# Altium project stm32f103c8t6.PrjPcb
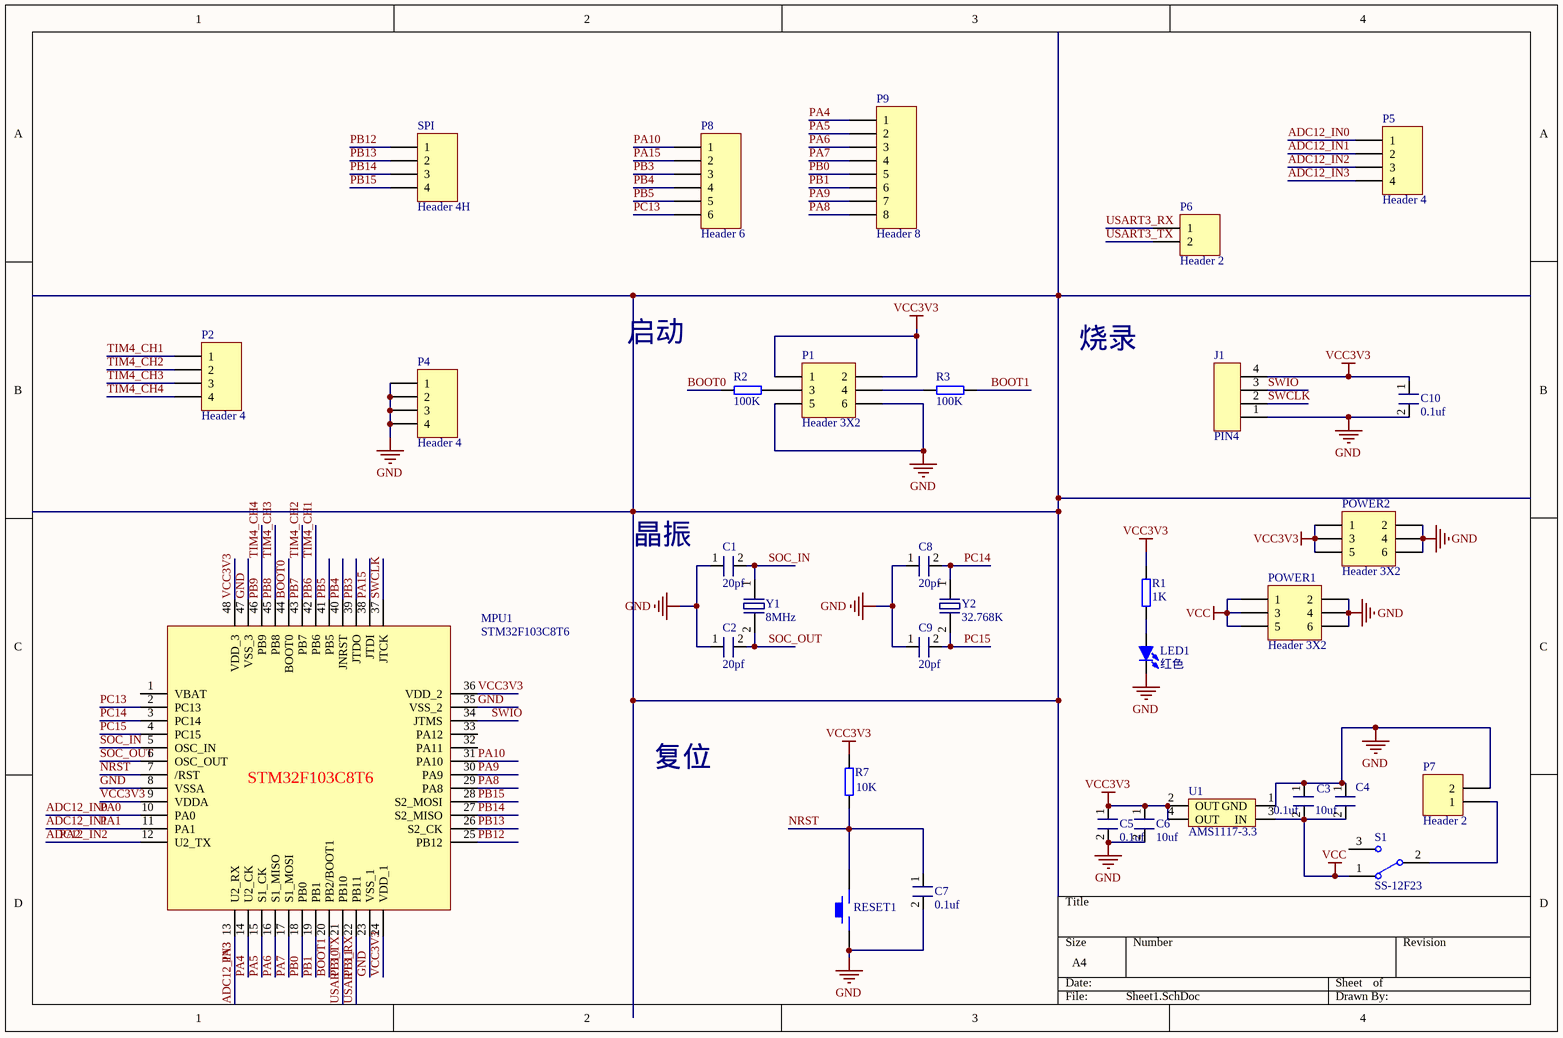
[diagram p0: Sheet1.SchDoc]
2 sheets, 46 parts. Net scope: global (net labels, ports and power ports of the same name join across sheets).
Board file: PCB1.PcbDoc
Sheets:
  Sheet1.SchDoc
  Sheet3.SchDoc

## Sheet Sheet1.SchDoc
size A4

### Parts
C1  20pf  [0603-C]
C2  20pf  [0603-C]
C3  0.1uf  [0603-C]
C4  10uf  [0603-C]
C5  0.1uf  [0603-C]
C6  10uf  [0603-C]
C7  0.1uf  [0603-C]
C8  20pf  [0603-C]
C9  20pf  [0603-C]
C10  0.1uf  [0603-C]
J1  PIN4  [HDR-1X4_H]
LED1  红色  [LED 0603W]
MPU1  STM32F103C8T6  [stm32f103c8t6]
P1  Header 3X2  [HDR2X3]
P2  Header 4  [HDR1X4]
P4  Header 4  [HDR1X4]
P5  Header 4  [HDR1X4]
P6  Header 2  [HDR-1X2_H]
P7  Header 2  [TX60PW-F20]
P8  Header 6  [HDR1X6]
P9  Header 8  [HDR1X8]
POWER1  Header 3X2  [HDR-3X2]
POWER2  Header 3X2  [HDR-3X2]
R1  1K  [0603-R]
R2  100K  [0603-R]
R3  100K  [0603-R]
R7  10K  [0603-R]
RESET1  KEY_M  [TSW SMD-6*6*11]  (value not drawn)
S1  SS-12F23  [SS-12D10]
SPI  Header 4H  [HDR1X4H]
U1  AMS1117-3.3  [AMS1117]
Y1  8MHz  [XTAL]
Y2  32.768K  [SMD8038-4]

### Nets
GND: C1.1 C2.1 C3.1 C4.1 C5.2 C6.2 C7.2 C8.1 C9.1 C10.2 J1.1 LED1.2(K) MPU1.8(VSSA) MPU1.23(VSS_1) MPU1.35(VSS_2) MPU1.47(VSS_3) P1.5 P1.6 P4.1 P4.2 P4.3 P4.4 P7.2 POWER1.2 POWER1.4 POWER1.6 POWER2.2 POWER2.4 POWER2.6 RESET1.1 U1.1(GND)
VCC: C3.2 C4.2 POWER1.1 POWER1.3 POWER1.5 S1.1 U1.3(IN)
VCC3V3: C5.1 C6.1 C10.1 J1.4 MPU1.9(VDDA) MPU1.24(VDD_1) MPU1.36(VDD_2) MPU1.48(VDD_3) P1.1 P1.2 POWER2.1 POWER2.3 POWER2.5 R1.1 R7.2 U1.2(OUT) U1.4(OUT)
ADC12_IN0: MPU1.10(PA0) P5.1  [also labelled PA0]
ADC12_IN1: MPU1.11(PA1) P5.2  [also labelled PA1]
ADC12_IN2: MPU1.12(U2_TX) P5.3  [also labelled PA2]
ADC12_IN3: MPU1.13(U2_RX) P5.4  [also labelled PA3]
BOOT0: MPU1.44(BOOT0) R2.1
BOOT1: MPU1.20(PB2/BOOT1) R3.2
NRST: C7.1 MPU1.7(/RST) R7.1 RESET1.2
PA4: MPU1.14(U2_CK) P9.1
PA5: MPU1.15(S1_CK) P9.2
PA6: MPU1.16(S1_MISO) P9.3
PA7: MPU1.17(S1_MOSI) P9.4
PA8: MPU1.29(PA8) P9.8
PA9: MPU1.30(PA9) P9.7
PA10: MPU1.31(PA10) P8.1
PA15: MPU1.38(JTDI) P8.2
PB0: MPU1.18(PB0) P9.5
PB1: MPU1.19(PB1) P9.6
PB3: MPU1.39(JTDO) P8.3
PB4: MPU1.40(JNRST) P8.4
PB5: MPU1.41(PB5) P8.5
PB6: MPU1.42(PB6) P2.1  [also labelled TIM4_CH1]
PB7: MPU1.43(PB7) P2.2  [also labelled TIM4_CH2]
PB8: MPU1.45(PB8) P2.3  [also labelled TIM4_CH3]
PB9: MPU1.46(PB9) P2.4  [also labelled TIM4_CH4]
PB10: MPU1.21(PB10) P6.2  [also labelled USART3_TX]
PB11: MPU1.22(PB11) P6.1  [also labelled USART3_RX]
PB12: MPU1.25(PB12) SPI.1
PB13: MPU1.26(S2_CK) SPI.2
PB14: MPU1.27(S2_MISO) SPI.3
PB15: MPU1.28(S2_MOSI) SPI.4
PC13: MPU1.2(PC13) P8.6
PC14: C8.2 MPU1.3(PC14) Y2.1
PC15: C9.2 MPU1.4(PC15) Y2.2
SOC_IN: C1.2 MPU1.5(OSC_IN) Y1.1
SOC_OUT: C2.2 MPU1.6(OSC_OUT) Y1.2
SWCLK: J1.2 MPU1.37(JTCK)
SWIO: J1.3 MPU1.34(JTMS)
NetLED1_1: LED1.1(A) R1.2
NetP1_3: P1.3 R2.2
NetP1_4: P1.4 R3.1
NetP7_1: P7.1 S1.2

Not connected (* = marked no-connect by the designer): MPU1 1(VBAT) 32(PA11) 33(PA12); S1 3

### Notes on the sheet
- 启动
- 烧录
- 晶振
- 复位

### Library data of the parts
C1-C10 = Cap
LED1 = LED-SMD: 贴片LED; 版权归属: 黎明电子style; BOM名称: 贴片LED; 学习资源: https://lmdzstyle.taobao.com/
P1 POWER1 POWER2 = Header 3X2: Header, 3-Pin, Dual row; LatestRevisionDate: 17-Jul-2002; LatestRevisionNote: Re-released for DXP Platform.; Publisher: Altium Limited
P2 P4 P5 = Header 4: Header, 4-Pin; LatestRevisionDate: 17-Jul-2002; LatestRevisionNote: Re-released for DXP Platform.; Publisher: Altium Limited
P6 P7 = Header 2: Header, 2-Pin; LatestRevisionDate: 17-Jul-2002; LatestRevisionNote: Re-released for DXP Platform.; Publisher: Altium Limited
P8 = Header 6: Header, 6-Pin; LatestRevisionDate: 17-Jul-2002; LatestRevisionNote: Re-released for DXP Platform.; Publisher: Altium Limited
P9 = Header 8: Header, 8-Pin; LatestRevisionDate: 17-Jul-2002; LatestRevisionNote: Re-released for DXP Platform.; Publisher: Altium Limited
R1-R3 R7 = RES-SMD
S1 = SSW-1P: 1路波动开关; BOM名称: 波动开关; 版权归属: 黎明电子style; 学习资源: https://lmdzstyle.taobao.com/
SPI = Header 4H: Header, 4-Pin, Right Angle; LatestRevisionDate: 17-Jul-2002; LatestRevisionNote: Re-released for DXP Platform.; Publisher: Altium Limited
U1 = AMS1117
Y1 Y2 = XTAL

## Sheet Sheet3.SchDoc
size A4
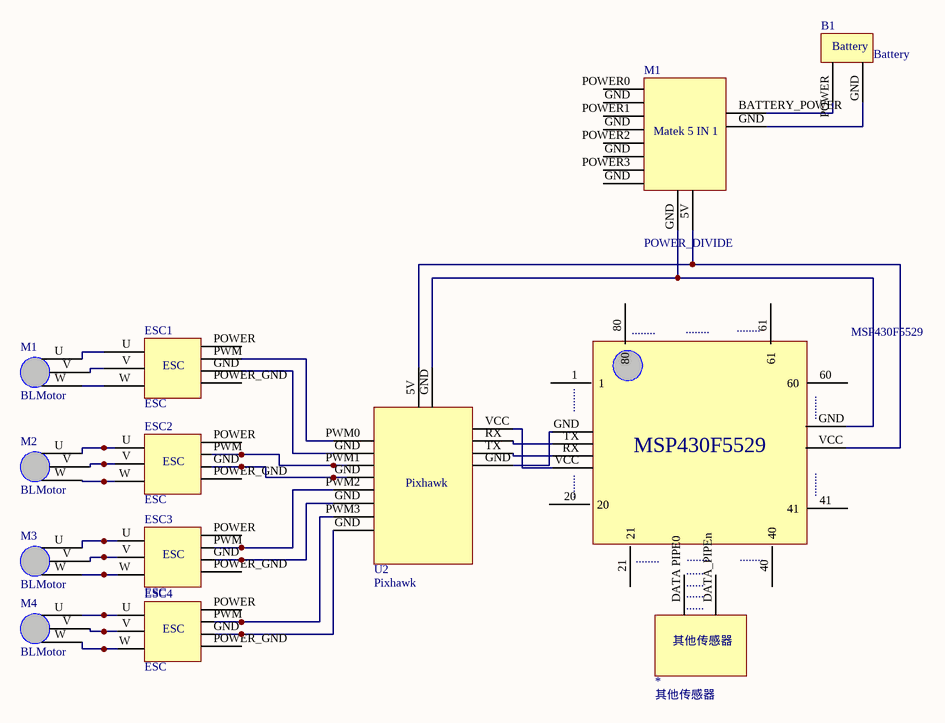
[diagram p1: Sheet3.SchDoc]

### Parts
(Parts that share a designator on the sheet are numbered #1, #2 ... from top to bottom, then left to right.)
*  其他传感器
B1  Battery
ESC1  ESC
ESC2  ESC
ESC3  ESC
ESC4  ESC
M1#1  POWER_DIVIDE
M1#2  BLMotor
M2  BLMotor
M3  BLMotor
M4  BLMotor
U2  Pixhawk
  MSP430F5529

### Nets
NetB1_GND: B1.GND M1#1.GND
NetB1_POWER: B1.POWER M1#1.BATTERY_POWER
NetESC1_GND: ESC1.GND U2.GND
NetESC1_PWM: ESC1.PWM U2.PWM0
NetESC1_U: ESC1.U M1#2.U
NetESC1_V: ESC1.V M1#2.V
NetESC1_W: ESC1.W M1#2.W
NetESC2_GND: ESC2.GND U2.GND
NetESC2_PWM: ESC2.PWM U2.PWM1
NetESC2_U: ESC2.U M2.U
NetESC2_V: ESC2.V M2.V
NetESC2_W: ESC2.W M2.W
NetESC3_GND: ESC3.GND U2.GND
NetESC3_PWM: ESC3.PWM U2.PWM2
NetESC3_U: ESC3.U M3.U
NetESC3_V: ESC3.V M3.V
NetESC3_W: ESC3.W M3.W
NetESC4_GND: ESC4.GND U2.GND
NetESC4_PWM: ESC4.PWM U2.PWM3
NetESC4_U: ESC4.U M4.U
NetESC4_V: ESC4.V M4.V
NetESC4_W: ESC4.W M4.W
NetM1#1_5V: M1#1.5V U2.5V .VCC
NetM1#1_GND: M1#1.GND U2.GND .GND
NetU2_GND: U2.GND .GND
NetU2_RX: U2.RX .TX
NetU2_TX: U2.TX .RX
NetU2_VCC: U2.VCC .VCC

Not connected (* = marked no-connect by the designer): * DATA PIPE0(98) DATA_PIPEn(99); ESC1 POWER(86) POWER_GND(87); ESC2 POWER(86) POWER_GND(87); ESC3 POWER(86) POWER_GND(87); ESC4 POWER(86) POWER_GND(87); M1#1 POWER0(90) POWER1(92) POWER2(90) POWER3(92);  1 20 21 40 41 60 61 80

### Notes on the sheet
- (in symbol MSP430F5529) ........
- (in symbol POWER_DIVIDE) Matek 5 IN 1
- (in symbol 其他传感器) ......